# EAGLE schematic Sequencer-Logic-Prod-V2.1 (EAGLE 9.6.2)

## Sheet 1 of 10: uCode PC Counter
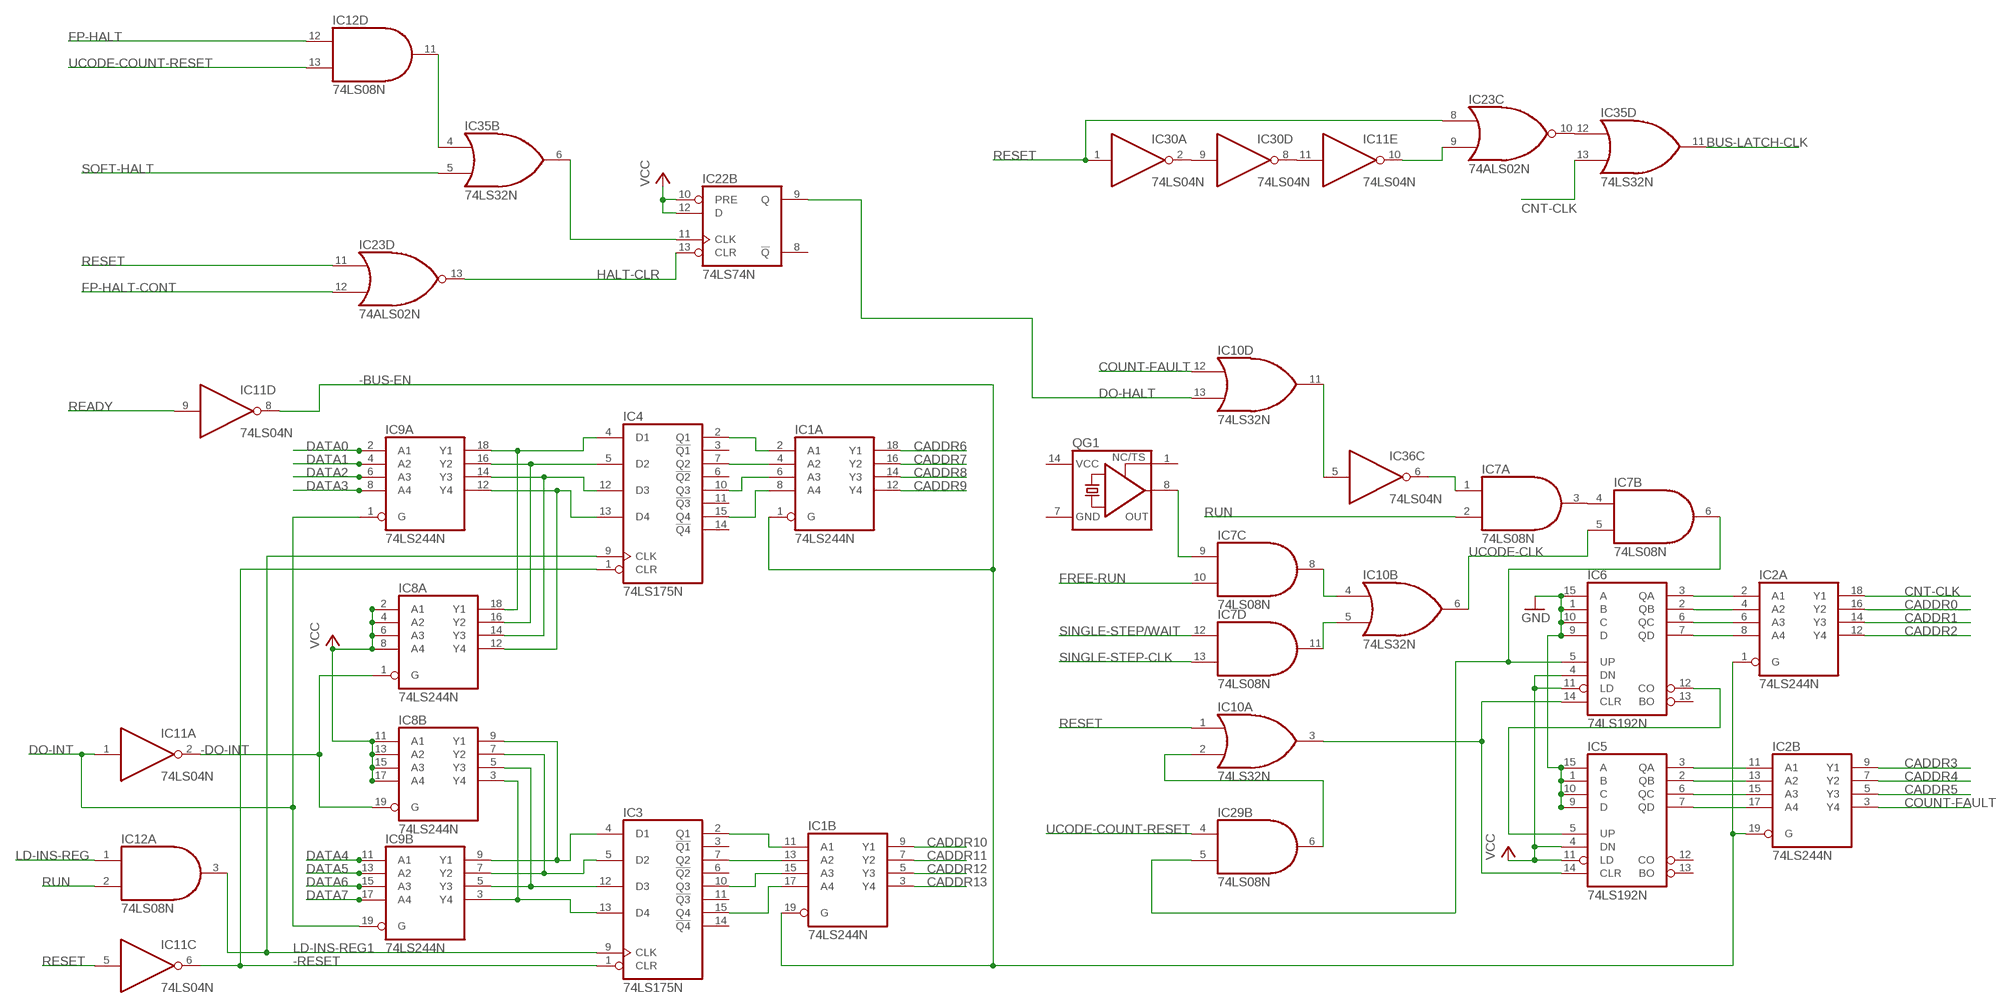
[diagram p0: schematic, sheet 1]

### Parts
IC1  74LS244N  [DIL20]
IC2  74LS244N  [DIL20]
IC3  74LS175N  [DIL16]
IC4  74LS175N  [DIL16]
IC5  74LS192N  [DIL16]
IC6  74LS192N  [DIL16]
IC7  74LS08N  [DIL14]
IC8  74LS244N  [DIL20]
IC9  74LS244N  [DIL20]
IC10  74LS32N  [DIL14]
IC11  74LS04N  [DIL14]
IC12  74LS08N  [DIL14]
IC22  74LS74N  [DIL14]
IC23  74ALS02N  [DIL14]
IC29  74LS08N  [DIL14]
IC30  74LS04N  [DIL14]
IC35  74LS32N  [DIL14]
IC36  74LS04N  [DIL14]
QG1  XO-14  [DIL14S]

### Nets
-BUS-EN: IC1.1(A:G) IC1.19(B:G) IC2.1(A:G) IC2.19(B:G) IC11.8(D:O) ; also sheet 2,10
-DO-INT: IC8.1(A:G) IC8.19(B:G) IC11.2(A:O)
-RESET: IC3.1(CLR) IC4.1(CLR) IC11.6(C:O) ; also sheet 10
BUS-LATCH-CLK: IC35.11(D:O) ; also sheet 2
CADDR0: IC2.16(A:Y2) ; also sheet 9
CADDR1: IC2.14(A:Y3) ; also sheet 9
CADDR2: IC2.12(A:Y4) ; also sheet 9
CADDR3: IC2.9(B:Y1) ; also sheet 9
CADDR4: IC2.7(B:Y2) ; also sheet 9
CADDR5: IC2.5(B:Y3) ; also sheet 9
CADDR6: IC1.18(A:Y1) ; also sheet 9
CADDR7: IC1.16(A:Y2) ; also sheet 9
CADDR8: IC1.14(A:Y3) ; also sheet 9
CADDR9: IC1.12(A:Y4) ; also sheet 9
CADDR10: IC1.9(B:Y1) ; also sheet 9
CADDR11: IC1.7(B:Y2) ; also sheet 9
CADDR12: IC1.5(B:Y3) ; also sheet 9
CADDR13: IC1.3(B:Y4) ; also sheet 9
CNT-CLK: IC2.18(A:Y1) IC35.13(D:I1)
COUNT-FAULT: IC2.3(B:Y4) IC10.12(D:I0)
COUNT-RESET: IC5.14(CLR) IC6.14(CLR) IC10.3(A:O)
DATA0: IC9.2(A:A1) ; also sheet 4,6,10
DATA1: IC9.4(A:A2) ; also sheet 4,6,10
DATA2: IC9.6(A:A3) ; also sheet 4,6,10
DATA3: IC9.8(A:A4) ; also sheet 4,6,10
DATA4: IC9.11(B:A1) ; also sheet 4,6,10
DATA5: IC9.13(B:A2) ; also sheet 4,6,10
DATA6: IC9.15(B:A3) ; also sheet 4,6,10
DATA7: IC9.17(B:A4) ; also sheet 4,6,10
DO-HALT: IC10.13(D:I1) IC22.9(B:Q)
DO-INT: IC9.1(A:G) IC9.19(B:G) IC11.1(A:I) ; also sheet 3
FP-HALT: IC12.12(D:I0) ; also sheet 5
FP-HALT-CONT: IC23.12(D:I1) ; also sheet 5
FREE-RUN: IC7.10(C:I1) ; also sheet 5
GND: IC5.1(B) IC5.9(D) IC5.10(C) IC5.15(A) IC6.1(B) IC6.9(D) IC6.10(C) IC6.15(A) ; also sheet 3,5,6,7,8,9,10
HALT-CLR: IC22.13(B:CLR) IC23.13(D:O)
LD-INS-REG: IC12.1(A:I0) ; also sheet 2
LD-INS-REG1: IC3.9(CLK) IC4.9(CLK) IC12.3(A:O)
N$1: IC5.5(UP) IC6.12(CO)
N$2: IC1.2(A:A1) IC4.2(Q1)
N$3: IC1.4(A:A2) IC4.7(Q2)
N$4: IC6.5(UP) IC7.6(B:O) IC29.5(B:I1)
N$5: IC4.4(D1) IC8.18(A:Y1) IC9.18(A:Y1)
N$6: IC4.5(D2) IC8.16(A:Y2) IC9.16(A:Y2)
N$7: IC2.2(A:A1) IC6.3(QA)
N$8: IC2.4(A:A2) IC6.2(QB)
N$9: IC2.6(A:A3) IC6.6(QC)
N$10: IC1.6(A:A3) IC4.10(Q3)
N$11: IC2.8(A:A4) IC6.7(QD)
N$12: IC2.11(B:A1) IC5.3(QA)
N$13: IC2.13(B:A2) IC5.2(QB)
N$14: IC2.15(B:A3) IC5.6(QC)
N$15: IC2.17(B:A4) IC5.7(QD)
N$16: IC7.1(A:I0) IC36.6(C:O)
N$17: IC4.12(D3) IC8.14(A:Y3) IC9.14(A:Y3)
N$18: IC4.13(D4) IC8.12(A:Y4) IC9.12(A:Y4)
N$19: IC3.4(D1) IC8.9(B:Y1) IC9.9(B:Y1)
N$20: IC3.5(D2) IC8.7(B:Y2) IC9.7(B:Y2)
N$21: IC3.12(D3) IC8.5(B:Y3) IC9.5(B:Y3)
N$22: IC3.13(D4) IC8.3(B:Y4) IC9.3(B:Y4)
N$23: IC1.8(A:A4) IC4.15(Q4)
N$26: IC10.11(D:O) IC36.5(C:I)
N$31: IC7.3(A:O) IC7.4(B:I0)
N$32: IC23.10(C:O) IC35.12(D:I0)
N$33: IC22.11(B:CLK) IC35.6(B:O)
N$34: IC1.11(B:A1) IC3.2(Q1)
N$35: IC1.13(B:A2) IC3.7(Q2)
N$36: IC1.15(B:A3) IC3.10(Q3)
N$37: IC1.17(B:A4) IC3.15(Q4)
N$38: IC7.11(D:O) IC10.5(B:I1)
N$39: IC7.8(C:O) IC10.4(B:I0)
N$40: IC7.9(C:I0) QG1.8(OUT)
N$42: IC11.11(E:I) IC30.8(D:O)
N$44: IC30.2(A:O) IC30.9(D:I)
N$46: IC11.10(E:O) IC23.9(C:I1)
N$54: IC12.11(D:O) IC35.4(B:I0)
N$55: IC10.2(A:I1) IC29.6(B:O)
READY: IC11.9(D:I) ; also sheet 9
RESET: IC10.1(A:I0) IC11.5(C:I) IC23.8(C:I0) IC23.11(D:I0) IC30.1(A:I) ; also sheet 3,5
RUN: IC7.2(A:I1) IC12.2(A:I1) ; also sheet 5
SINGLE-STEP-CLK: IC7.13(D:I1) ; also sheet 5
SINGLE-STEP/WAIT: IC7.12(D:I0) ; also sheet 5
SOFT-HALT: IC35.5(B:I1) ; also sheet 2
UCODE-CLK: IC7.5(B:I1) IC10.6(B:O)
UCODE-COUNT-RESET: IC12.13(D:I1) IC29.4(B:I0) ; also sheet 2,4
VCC: IC5.4(DN) IC5.11(LD) IC6.4(DN) IC6.11(LD) IC8.2(A:A1) IC8.4(A:A2) IC8.6(A:A3) IC8.8(A:A4) IC8.11(B:A1) IC8.13(B:A2) IC8.15(B:A3) IC8.17(B:A4) IC22.10(B:PRE) IC22.12(B:D) ; also sheet 3,5,7,9,10
Unconnected: IC3.3(!Q1) IC3.6(!Q2) IC3.11(!Q3) IC3.14(!Q4) IC4.3(!Q1) IC4.6(!Q2) IC4.11(!Q3) IC4.14(!Q4) IC5.12(CO) IC5.13(BO) IC6.13(BO) IC22.8(B:!Q) QG1.1(TS)

## Sheet 2 of 10: Latching
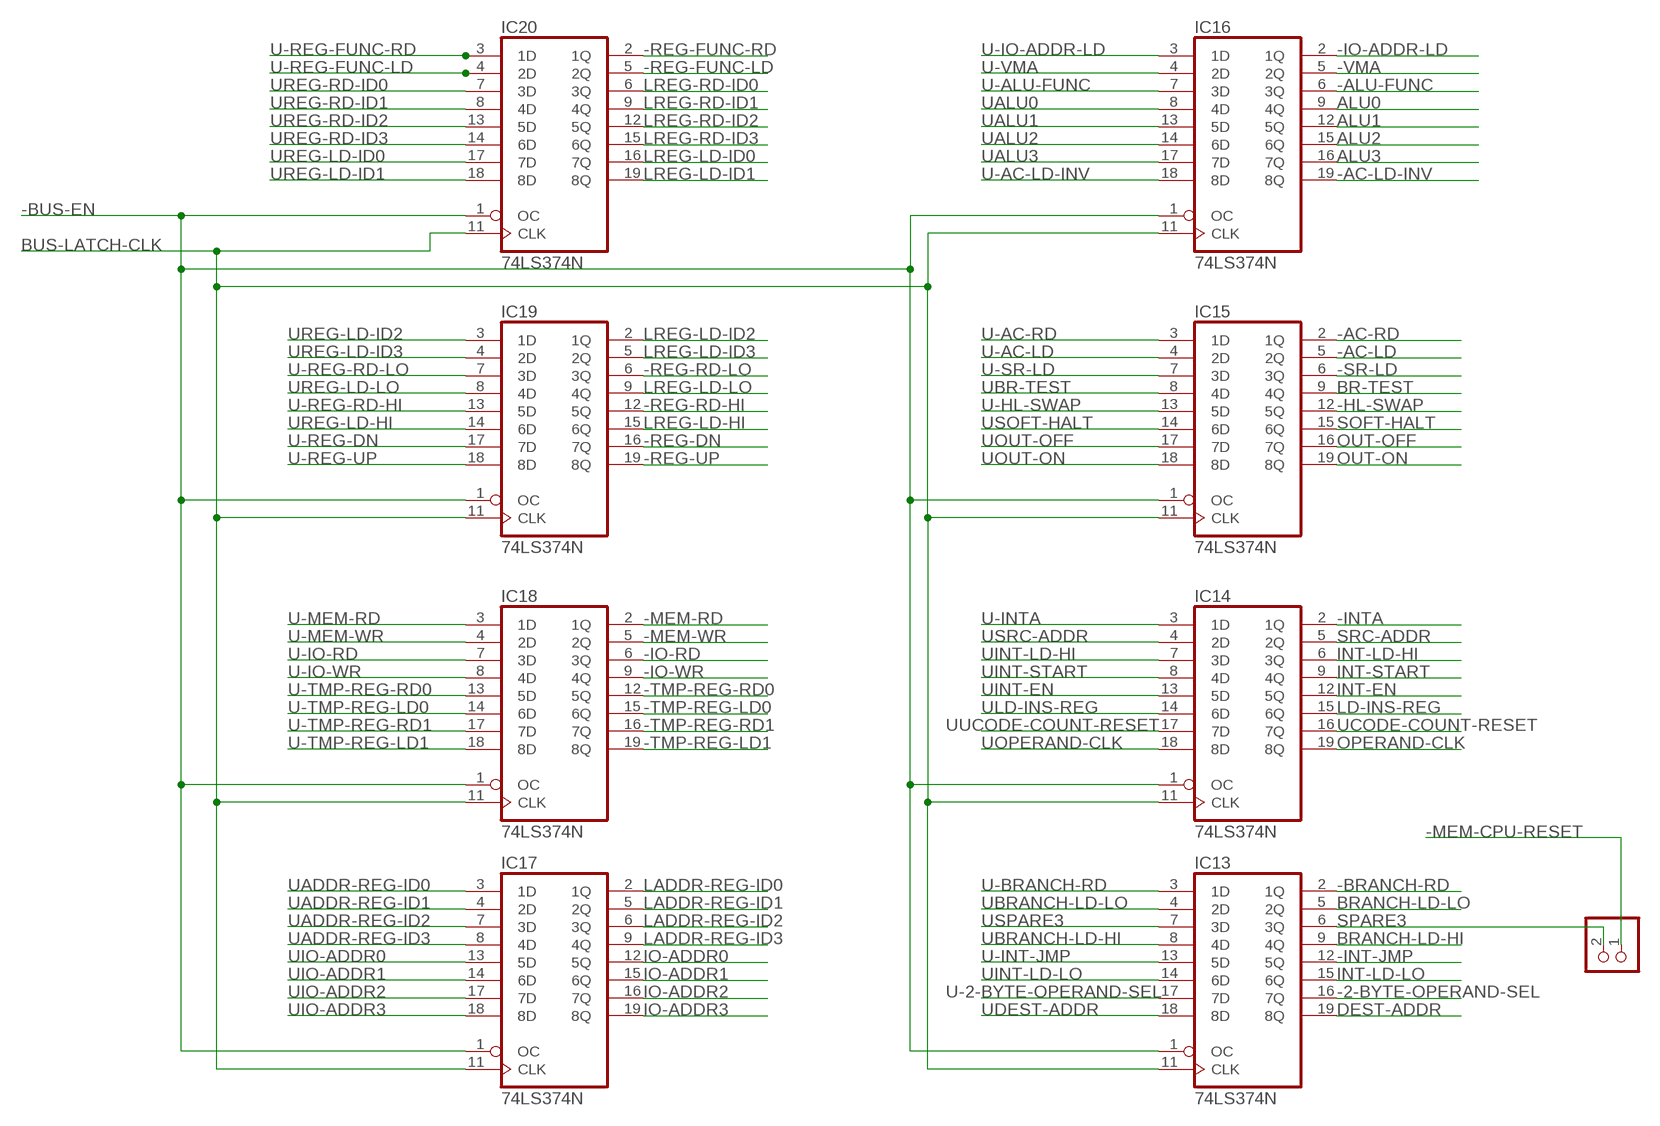
[diagram p1: schematic, sheet 2]

### Parts
IC13  74LS374N  [DIL20]
IC14  74LS374N  [DIL20]
IC15  74LS374N  [DIL20]
IC16  74LS374N  [DIL20]
IC17  74LS374N  [DIL20]
IC18  74LS374N  [DIL20]
IC19  74LS374N  [DIL20]
IC20  74LS374N  [DIL20]
JP2  PINHD-1X2  [1X02]

### Nets
-2-BYTE-OPERAND-SEL: IC13.16(7Q) ; also sheet 6
-AC-LD: IC15.5(2Q) ; also sheet 10
-AC-LD-INV: IC16.19(8Q) ; also sheet 10
-AC-RD: IC15.2(1Q) ; also sheet 10
-ALU-FUNC: IC16.6(3Q) ; also sheet 10
-BRANCH-RD: IC13.2(1Q) ; also sheet 4
-BUS-EN: IC13.1(OC) IC14.1(OC) IC15.1(OC) IC16.1(OC) IC17.1(OC) IC18.1(OC) IC19.1(OC) IC20.1(OC) ; also sheet 1,10
-HL-SWAP: IC15.12(5Q) ; also sheet 10
-INT-JMP: IC13.12(5Q) ; also sheet 4
-INTA: IC14.2(1Q) ; also sheet 10
-IO-ADDR-LD: IC16.2(1Q) ; also sheet 10
-IO-RD: IC18.6(3Q) ; also sheet 10
-IO-WR: IC18.9(4Q) ; also sheet 10
-MEM-CPU-RESET: JP2.1 ; also sheet 9
-MEM-RD: IC18.2(1Q) ; also sheet 10
-MEM-WR: IC18.5(2Q) ; also sheet 10
-REG-DN: IC19.16(7Q) ; also sheet 10
-REG-FUNC-LD: IC20.5(2Q) ; also sheet 10
-REG-FUNC-RD: IC20.2(1Q) ; also sheet 10
-REG-RD-HI: IC19.12(5Q) ; also sheet 10
-REG-RD-LO: IC19.6(3Q) ; also sheet 10
-REG-UP: IC19.19(8Q) ; also sheet 10
-SR-LD: IC15.6(3Q) ; also sheet 10
-TMP-REG-LD0: IC18.15(6Q) ; also sheet 10
-TMP-REG-LD1: IC18.19(8Q) ; also sheet 10
-TMP-REG-RD0: IC18.12(5Q) ; also sheet 10
-TMP-REG-RD1: IC18.16(7Q) ; also sheet 10
-VMA: IC16.5(2Q) ; also sheet 10
ALU0: IC16.9(4Q) ; also sheet 10
ALU1: IC16.12(5Q) ; also sheet 10
ALU2: IC16.15(6Q) ; also sheet 10
ALU3: IC16.16(7Q) ; also sheet 10
BR-TEST: IC15.9(4Q) ; also sheet 4
BRANCH-LD-HI: IC13.9(4Q) ; also sheet 4
BRANCH-LD-LO: IC13.5(2Q) ; also sheet 4
BUS-LATCH-CLK: IC13.11(CLK) IC14.11(CLK) IC15.11(CLK) IC16.11(CLK) IC17.11(CLK) IC18.11(CLK) IC19.11(CLK) IC20.11(CLK) ; also sheet 1
DEST-ADDR: IC13.19(8Q) ; also sheet 6
INT-EN: IC14.12(5Q) ; also sheet 3
INT-LD-HI: IC14.6(3Q) ; also sheet 4
INT-LD-LO: IC13.15(6Q) ; also sheet 4
INT-START: IC14.9(4Q) ; also sheet 3
IO-ADDR0: IC17.12(5Q) ; also sheet 10
IO-ADDR1: IC17.15(6Q) ; also sheet 10
IO-ADDR2: IC17.16(7Q) ; also sheet 10
IO-ADDR3: IC17.19(8Q) ; also sheet 10
LADDR-REG-ID0: IC17.2(1Q) ; also sheet 6
LADDR-REG-ID1: IC17.5(2Q) ; also sheet 6
LADDR-REG-ID2: IC17.6(3Q) ; also sheet 6
LADDR-REG-ID3: IC17.9(4Q) ; also sheet 6
LD-INS-REG: IC14.15(6Q) ; also sheet 1
LREG-LD-HI: IC19.15(6Q) ; also sheet 4
LREG-LD-ID0: IC20.16(7Q) ; also sheet 6
LREG-LD-ID1: IC20.19(8Q) ; also sheet 6
LREG-LD-ID2: IC19.2(1Q) ; also sheet 6
LREG-LD-ID3: IC19.5(2Q) ; also sheet 6
LREG-LD-LO: IC19.9(4Q) ; also sheet 4
LREG-RD-ID0: IC20.6(3Q) ; also sheet 6
LREG-RD-ID1: IC20.9(4Q) ; also sheet 6
LREG-RD-ID2: IC20.12(5Q) ; also sheet 6
LREG-RD-ID3: IC20.15(6Q) ; also sheet 6
OPERAND-CLK: IC14.19(8Q) ; also sheet 6
OUT-OFF: IC15.16(7Q) ; also sheet 3
OUT-ON: IC15.19(8Q) ; also sheet 3
SOFT-HALT: IC15.15(6Q) ; also sheet 1
SPARE3: IC13.6(3Q) JP2.2
SRC-ADDR: IC14.5(2Q) ; also sheet 6
U-2-BYTE-OPERAND-SEL: IC13.17(7D) ; also sheet 9
U-AC-LD: IC15.4(2D) ; also sheet 9
U-AC-LD-INV: IC16.18(8D) ; also sheet 9
U-AC-RD: IC15.3(1D) ; also sheet 9
U-ALU-FUNC: IC16.7(3D) ; also sheet 9
U-BRANCH-RD: IC13.3(1D) ; also sheet 9
U-HL-SWAP: IC15.13(5D) ; also sheet 9
U-INT-JMP: IC13.13(5D) ; also sheet 9
U-INTA: IC14.3(1D) ; also sheet 9
U-IO-ADDR-LD: IC16.3(1D) ; also sheet 9
U-IO-RD: IC18.7(3D) ; also sheet 9
U-IO-WR: IC18.8(4D) ; also sheet 9
U-MEM-RD: IC18.3(1D) ; also sheet 9
U-MEM-WR: IC18.4(2D) ; also sheet 9
U-REG-DN: IC19.17(7D) ; also sheet 9
U-REG-FUNC-LD: IC20.4(2D) ; also sheet 9
U-REG-FUNC-RD: IC20.3(1D) ; also sheet 9
U-REG-RD-HI: IC19.13(5D) ; also sheet 9
U-REG-RD-LO: IC19.7(3D) ; also sheet 9
U-REG-UP: IC19.18(8D) ; also sheet 9
U-SR-LD: IC15.7(3D) ; also sheet 9
U-TMP-REG-LD0: IC18.14(6D) ; also sheet 9
U-TMP-REG-LD1: IC18.18(8D) ; also sheet 9
U-TMP-REG-RD0: IC18.13(5D) ; also sheet 9
U-TMP-REG-RD1: IC18.17(7D) ; also sheet 9
U-VMA: IC16.4(2D) ; also sheet 9
UADDR-REG-ID0: IC17.3(1D) ; also sheet 9
UADDR-REG-ID1: IC17.4(2D) ; also sheet 9
UADDR-REG-ID2: IC17.7(3D) ; also sheet 9
UADDR-REG-ID3: IC17.8(4D) ; also sheet 9
UALU0: IC16.8(4D) ; also sheet 9
UALU1: IC16.13(5D) ; also sheet 9
UALU2: IC16.14(6D) ; also sheet 9
UALU3: IC16.17(7D) ; also sheet 9
UBR-TEST: IC15.8(4D) ; also sheet 9
UBRANCH-LD-HI: IC13.8(4D) ; also sheet 9
UBRANCH-LD-LO: IC13.4(2D) ; also sheet 9
UCODE-COUNT-RESET: IC14.16(7Q) ; also sheet 1,4
UDEST-ADDR: IC13.18(8D) ; also sheet 9
UINT-EN: IC14.13(5D) ; also sheet 9
UINT-LD-HI: IC14.7(3D) ; also sheet 9
UINT-LD-LO: IC13.14(6D) ; also sheet 9
UINT-START: IC14.8(4D) ; also sheet 9
UIO-ADDR0: IC17.13(5D) ; also sheet 9
UIO-ADDR1: IC17.14(6D) ; also sheet 9
UIO-ADDR2: IC17.17(7D) ; also sheet 9
UIO-ADDR3: IC17.18(8D) ; also sheet 9
ULD-INS-REG: IC14.14(6D) ; also sheet 9
UOPERAND-CLK: IC14.18(8D) ; also sheet 9
UOUT-OFF: IC15.17(7D) ; also sheet 9
UOUT-ON: IC15.18(8D) ; also sheet 9
UREG-LD-HI: IC19.14(6D) ; also sheet 9
UREG-LD-ID0: IC20.17(7D) ; also sheet 9
UREG-LD-ID1: IC20.18(8D) ; also sheet 9
UREG-LD-ID2: IC19.3(1D) ; also sheet 9
UREG-LD-ID3: IC19.4(2D) ; also sheet 9
UREG-LD-LO: IC19.8(4D) ; also sheet 9
UREG-RD-ID0: IC20.7(3D) ; also sheet 9
UREG-RD-ID1: IC20.8(4D) ; also sheet 9
UREG-RD-ID2: IC20.13(5D) ; also sheet 9
UREG-RD-ID3: IC20.14(6D) ; also sheet 9
USOFT-HALT: IC15.14(6D) ; also sheet 9
USPARE3: IC13.7(3D) ; also sheet 9
USRC-ADDR: IC14.4(2D) ; also sheet 9
UUCODE-COUNT-RESET: IC14.17(7D) ; also sheet 9

## Sheet 3 of 10: Interrupt Mgmt
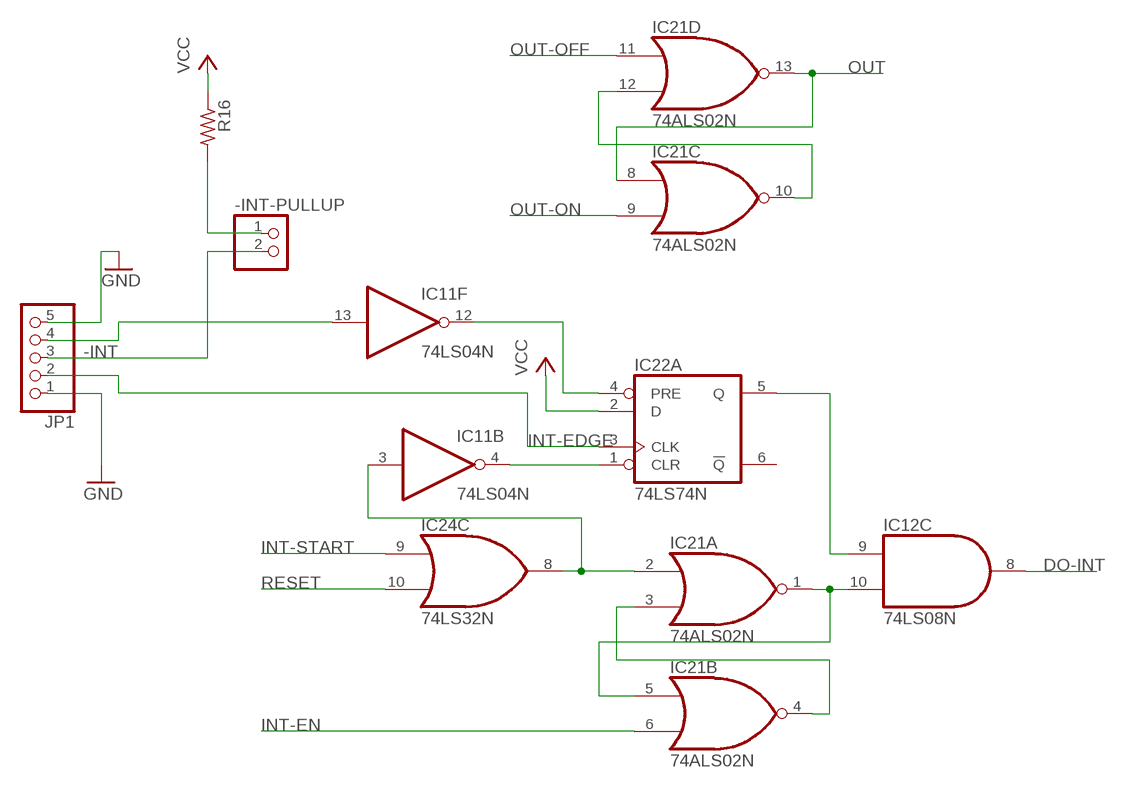
[diagram p2: schematic, sheet 3]

### Parts
-INT-PULLUP  PINHD-1X2  [1X02]
IC21  74ALS02N  [DIL14]
IC24  74LS32N  [DIL14]
JP1  PINHD-1X5  [1X05]
R16  10k  R-US_0207/10  [0207/10]

### Nets
-INT: -INT-PULLUP.2 JP1.3 ; also sheet 10
DO-INT: IC12.8(C:O) ; also sheet 1
GND: JP1.1 JP1.5 ; also sheet 1,5,6,7,8,9,10
INT-EDGE: IC22.3(A:CLK) JP1.2
INT-EN: IC21.6(B:I1) ; also sheet 2
INT-START: IC24.9(C:I0) ; also sheet 2
N$24: IC12.10(C:I1) IC21.1(A:O) IC21.5(B:I0)
N$25: IC21.3(A:I1) IC21.4(B:O)
N$27: IC11.3(B:I) IC21.2(A:I0) IC24.8(C:O)
N$28: IC12.9(C:I0) IC22.5(A:Q)
N$29: IC11.4(B:O) IC22.1(A:CLR)
N$41: IC11.12(F:O) IC22.4(A:PRE)
N$43: IC11.13(F:I) JP1.4
N$48: IC21.10(C:O) IC21.12(D:I1)
N$49: -INT-PULLUP.1 R16.2
OUT: IC21.8(C:I0) IC21.13(D:O) ; also sheet 5,10
OUT-OFF: IC21.11(D:I0) ; also sheet 2
OUT-ON: IC21.9(C:I1) ; also sheet 2
RESET: IC24.10(C:I1) ; also sheet 1,5
VCC: IC22.2(A:D) R16.1 ; also sheet 1,5,7,9,10
Unconnected: IC22.6(A:!Q)

## Sheet 4 of 10: Branch Mgmt
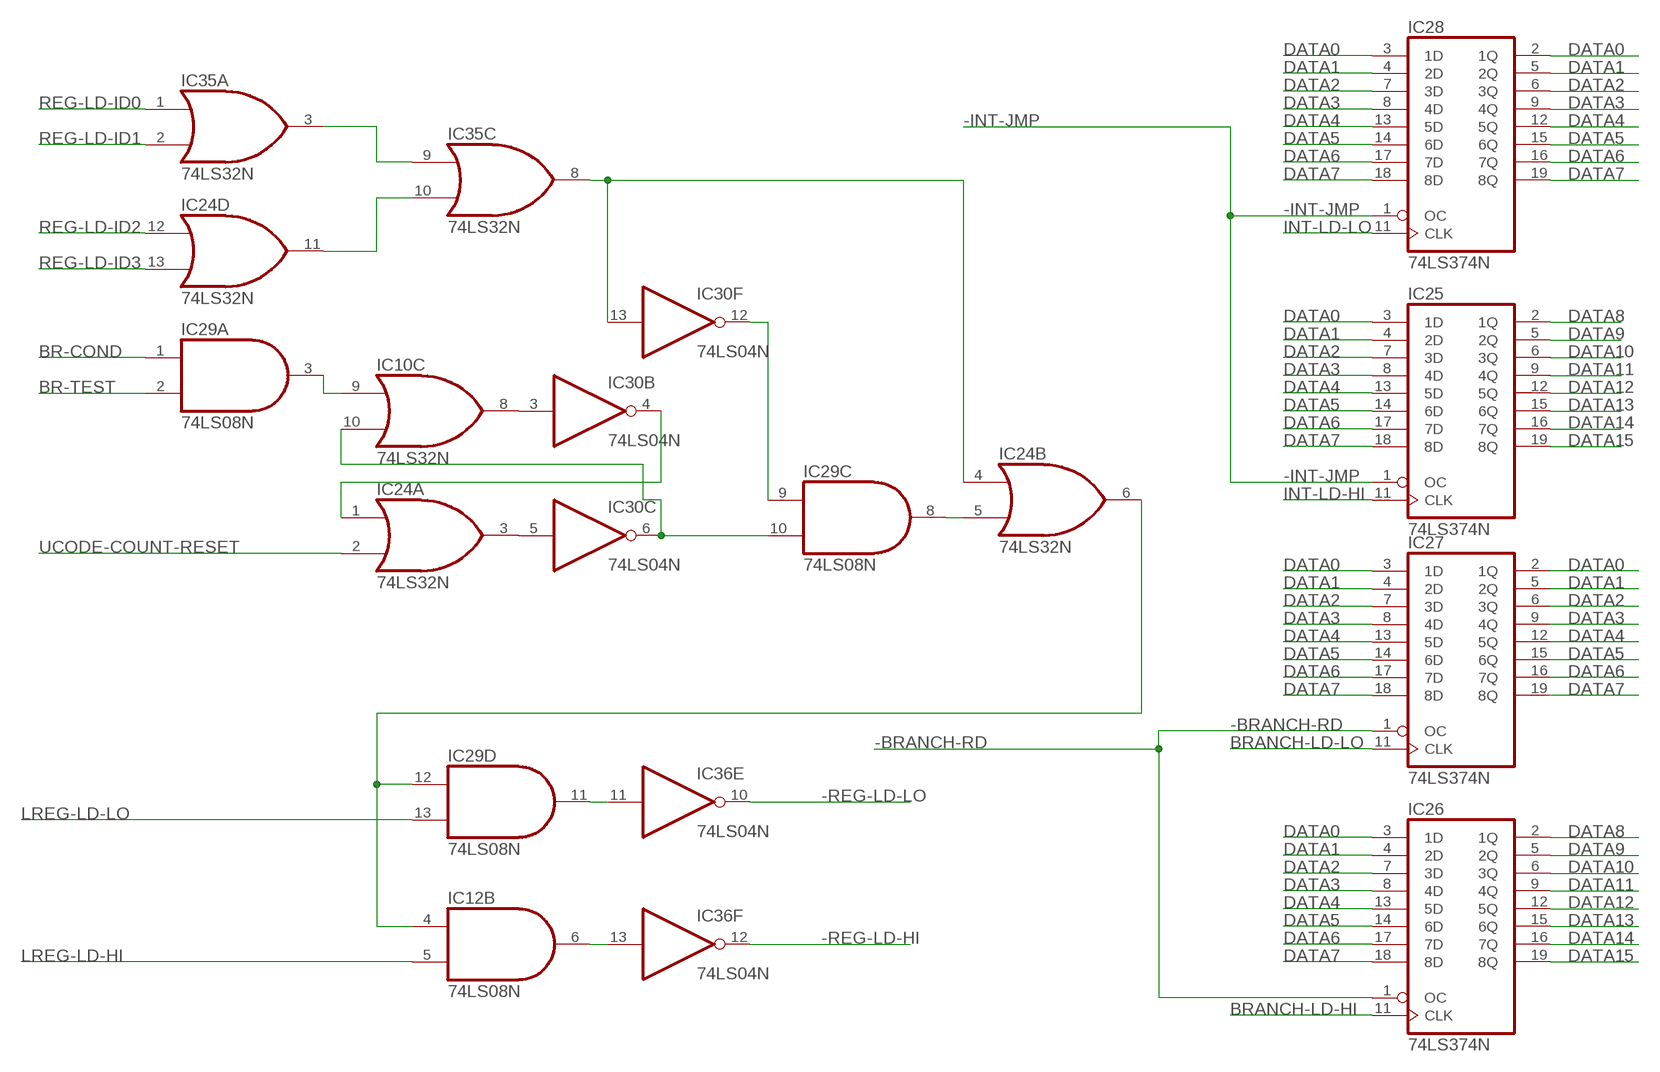
[diagram p3: schematic, sheet 4]

### Parts
IC25  74LS374N  [DIL20]
IC26  74LS374N  [DIL20]
IC27  74LS374N  [DIL20]
IC28  74LS374N  [DIL20]

### Nets
-BRANCH-RD: IC26.1(OC) IC27.1(OC) ; also sheet 2
-INT-JMP: IC25.1(OC) IC28.1(OC) ; also sheet 2
-REG-LD-HI: IC36.12(F:O) ; also sheet 10
-REG-LD-LO: IC36.10(E:O) ; also sheet 10
BR-COND: IC29.1(A:I0) ; also sheet 10
BR-TEST: IC29.2(A:I1) ; also sheet 2
BRANCH-LD-HI: IC26.11(CLK) ; also sheet 2
BRANCH-LD-LO: IC27.11(CLK) ; also sheet 2
DATA0: IC25.3(1D) IC26.3(1D) IC27.2(1Q) IC27.3(1D) IC28.2(1Q) IC28.3(1D) ; also sheet 1,6,10
DATA1: IC25.4(2D) IC26.4(2D) IC27.4(2D) IC27.5(2Q) IC28.4(2D) IC28.5(2Q) ; also sheet 1,6,10
DATA2: IC25.7(3D) IC26.7(3D) IC27.6(3Q) IC27.7(3D) IC28.6(3Q) IC28.7(3D) ; also sheet 1,6,10
DATA3: IC25.8(4D) IC26.8(4D) IC27.8(4D) IC27.9(4Q) IC28.8(4D) IC28.9(4Q) ; also sheet 1,6,10
DATA4: IC25.13(5D) IC26.13(5D) IC27.12(5Q) IC27.13(5D) IC28.12(5Q) IC28.13(5D) ; also sheet 1,6,10
DATA5: IC25.14(6D) IC26.14(6D) IC27.14(6D) IC27.15(6Q) IC28.14(6D) IC28.15(6Q) ; also sheet 1,6,10
DATA6: IC25.17(7D) IC26.17(7D) IC27.16(7Q) IC27.17(7D) IC28.16(7Q) IC28.17(7D) ; also sheet 1,6,10
DATA7: IC25.18(8D) IC26.18(8D) IC27.18(8D) IC27.19(8Q) IC28.18(8D) IC28.19(8Q) ; also sheet 1,6,10
DATA8: IC25.2(1Q) IC26.2(1Q) ; also sheet 10
DATA9: IC25.5(2Q) IC26.5(2Q) ; also sheet 10
DATA10: IC25.6(3Q) IC26.6(3Q) ; also sheet 10
DATA11: IC25.9(4Q) IC26.9(4Q) ; also sheet 10
DATA12: IC25.12(5Q) IC26.12(5Q) ; also sheet 10
DATA13: IC25.15(6Q) IC26.15(6Q) ; also sheet 10
DATA14: IC25.16(7Q) IC26.16(7Q) ; also sheet 10
DATA15: IC25.19(8Q) IC26.19(8Q) ; also sheet 10
INT-LD-HI: IC25.11(CLK) ; also sheet 2
INT-LD-LO: IC28.11(CLK) ; also sheet 2
LREG-LD-HI: IC12.5(B:I1) ; also sheet 2
LREG-LD-LO: IC29.13(D:I1) ; also sheet 2
N$45: IC35.3(A:O) IC35.9(C:I0)
N$47: IC24.11(D:O) IC35.10(C:I1)
N$51: IC29.9(C:I0) IC30.12(F:O)
N$52: IC24.5(B:I1) IC29.8(C:O)
N$53: IC12.4(B:I0) IC24.6(B:O) IC29.12(D:I0)
N$56: IC24.4(B:I0) IC30.13(F:I) IC35.8(C:O)
N$57: IC29.11(D:O) IC36.11(E:I)
N$58: IC12.6(B:O) IC36.13(F:I)
N$60: IC10.8(C:O) IC30.3(B:I)
N$67: IC24.3(A:O) IC30.5(C:I)
N$70: IC24.1(A:I0) IC30.4(B:O)
N$71: IC10.10(C:I1) IC29.10(C:I1) IC30.6(C:O)
N$72: IC10.9(C:I0) IC29.3(A:O)
REG-LD-ID0: IC35.1(A:I0) ; also sheet 6,10
REG-LD-ID1: IC35.2(A:I1) ; also sheet 6,10
REG-LD-ID2: IC24.12(D:I0) ; also sheet 6,10
REG-LD-ID3: IC24.13(D:I1) ; also sheet 6,10
UCODE-COUNT-RESET: IC24.2(A:I1) ; also sheet 1,2

## Sheet 5 of 10: CONTROL INTERFACE
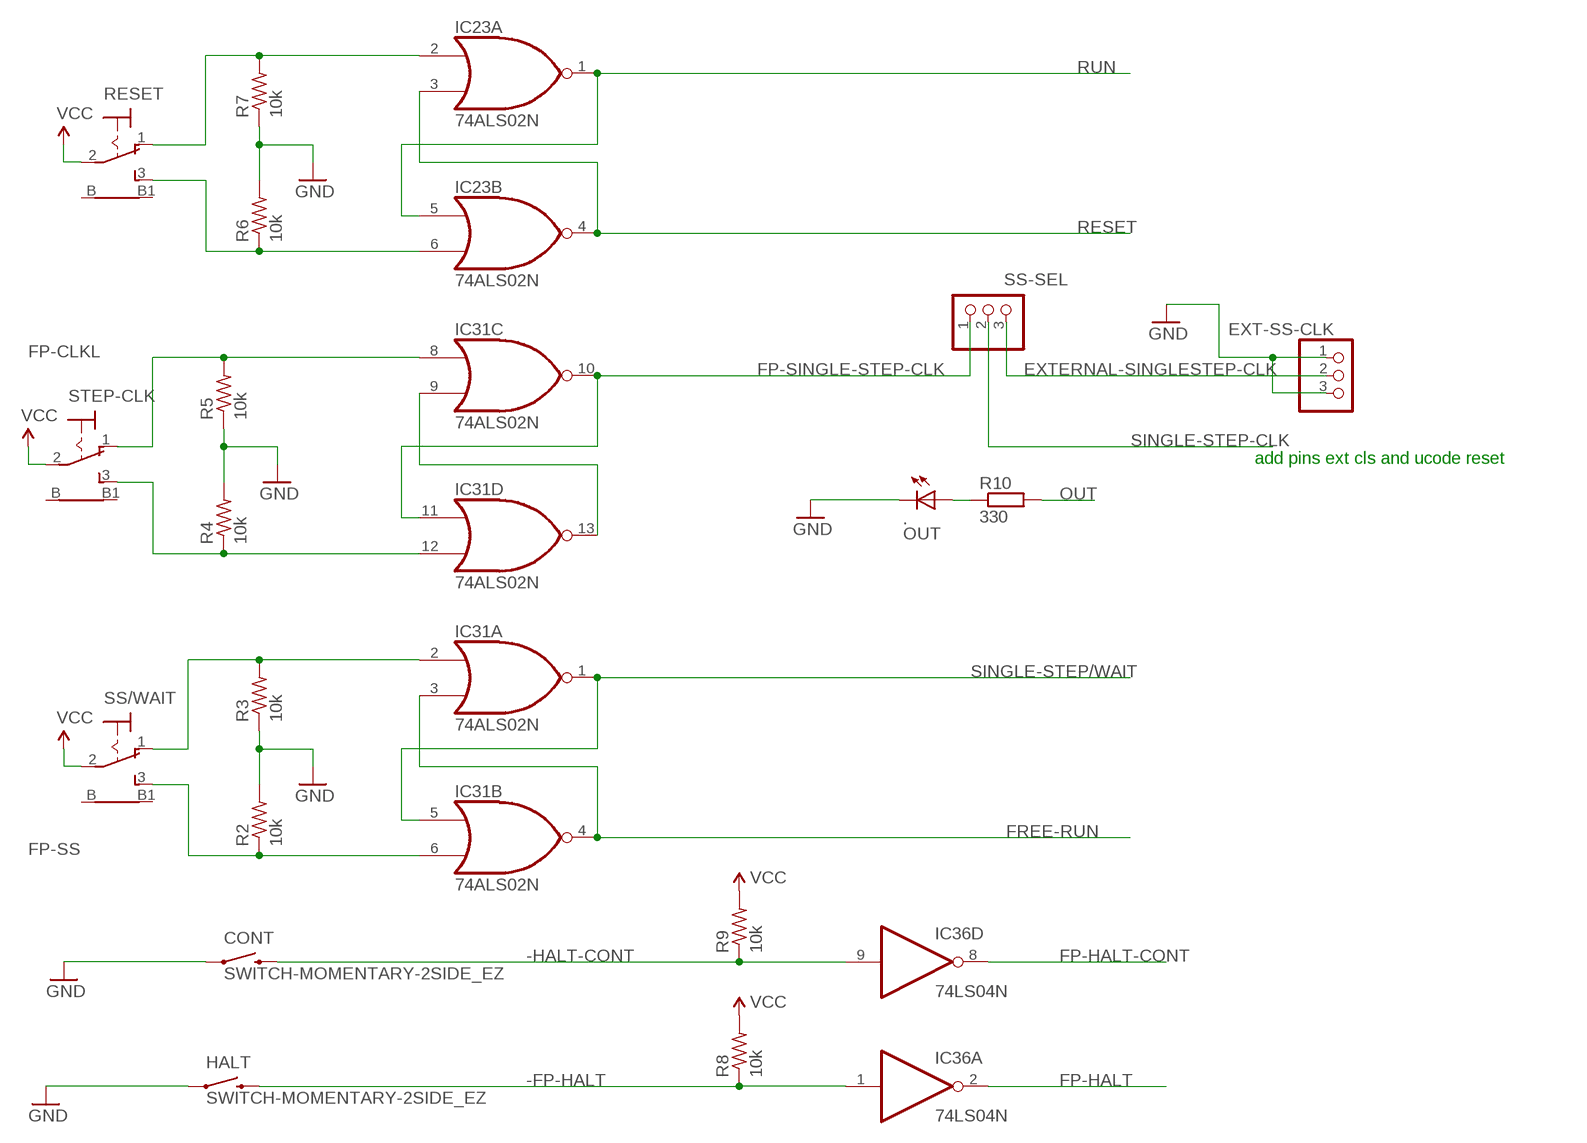
[diagram p4: schematic, sheet 5]

### Parts
.  OUT  LED5MM  [LED5MM]
CONT  SWITCH-MOMENTARY-2SIDE_EZ  [TACTILE-PTH-SIDEEZ]
EXT-SS-CLK  PINHD-1X3  [1X03]
HALT  SWITCH-MOMENTARY-2SIDE_EZ  [TACTILE-PTH-SIDEEZ]
IC31  74ALS02N  [DIL14]
R2  10k  R-US_0207/10  [0207/10]
R3  10k  R-US_0207/10  [0207/10]
R4  10k  R-US_0207/10  [0207/10]
R5  10k  R-US_0207/10  [0207/10]
R6  10k  R-US_0207/10  [0207/10]
R7  10k  R-US_0207/10  [0207/10]
R8  10k  R-US_0207/10  [0207/10]
R9  10k  R-US_0207/10  [0207/10]
R10  330  R0207/10  [0207/10]
RESET  9070-1W  [9070-1W]
SS-SEL  PINHD-1X3  [1X03]
SS/WAIT  9070-1W  [9070-1W]
STEP-CLK  9070-1W  [9070-1W]

### Nets
-FP-HALT: HALT.2 IC36.1(A:I) R8.1
-HALT-CONT: CONT.2 IC36.9(D:I) R9.1
EXTERNAL-SINGLESTEP-CLK: EXT-SS-CLK.2 SS-SEL.3
FP-CLKH: IC31.12(D:I1) R4.1 STEP-CLK.3(S)
FP-CLKL: IC31.8(C:I0) R5.2 STEP-CLK.1(O)
FP-EXECUTE: IC23.6(B:I1) R6.1 RESET.3(S)
FP-FREERUN: IC31.2(A:I0) R3.2 SS/WAIT.1(O)
FP-HALT: IC36.2(A:O) ; also sheet 1
FP-HALT-CONT: IC36.8(D:O) ; also sheet 1
FP-RESET: IC23.2(A:I0) R7.2 RESET.1(O)
FP-SINGLE-STEP-CLK: IC31.10(C:O) IC31.11(D:I0) SS-SEL.1
FP-SS: IC31.6(B:I1) R2.1 SS/WAIT.3(S)
FREE-RUN: IC31.3(A:I1) IC31.4(B:O) ; also sheet 1
GND: ..K(C) CONT.1 EXT-SS-CLK.1 EXT-SS-CLK.3 HALT.1 R2.2 R3.1 R4.2 R5.1 R6.2 R7.1 ; also sheet 1,3,6,7,8,9,10
HARD-RESET1: IC31.9(C:I1) IC31.13(D:O)
N$59: ..A R10.1
OUT: R10.2 ; also sheet 3,10
RESET: IC23.3(A:I1) IC23.4(B:O) ; also sheet 1,3
RUN: IC23.1(A:O) IC23.5(B:I0) ; also sheet 1
SINGLE-STEP-CLK: SS-SEL.2 ; also sheet 1
SINGLE-STEP/WAIT: IC31.1(A:O) IC31.5(B:I0) ; also sheet 1
VCC: R8.2 R9.2 RESET.2(P) SS/WAIT.2(P) STEP-CLK.2(P) ; also sheet 1,3,7,9,10
Unconnected: RESET.B RESET.B1 SS/WAIT.B SS/WAIT.B1 STEP-CLK.B STEP-CLK.B1

### Notes on the sheet
- add pins ext cls and ucode reset

## Sheet 6 of 10: OPERAND REGISTER MGMT
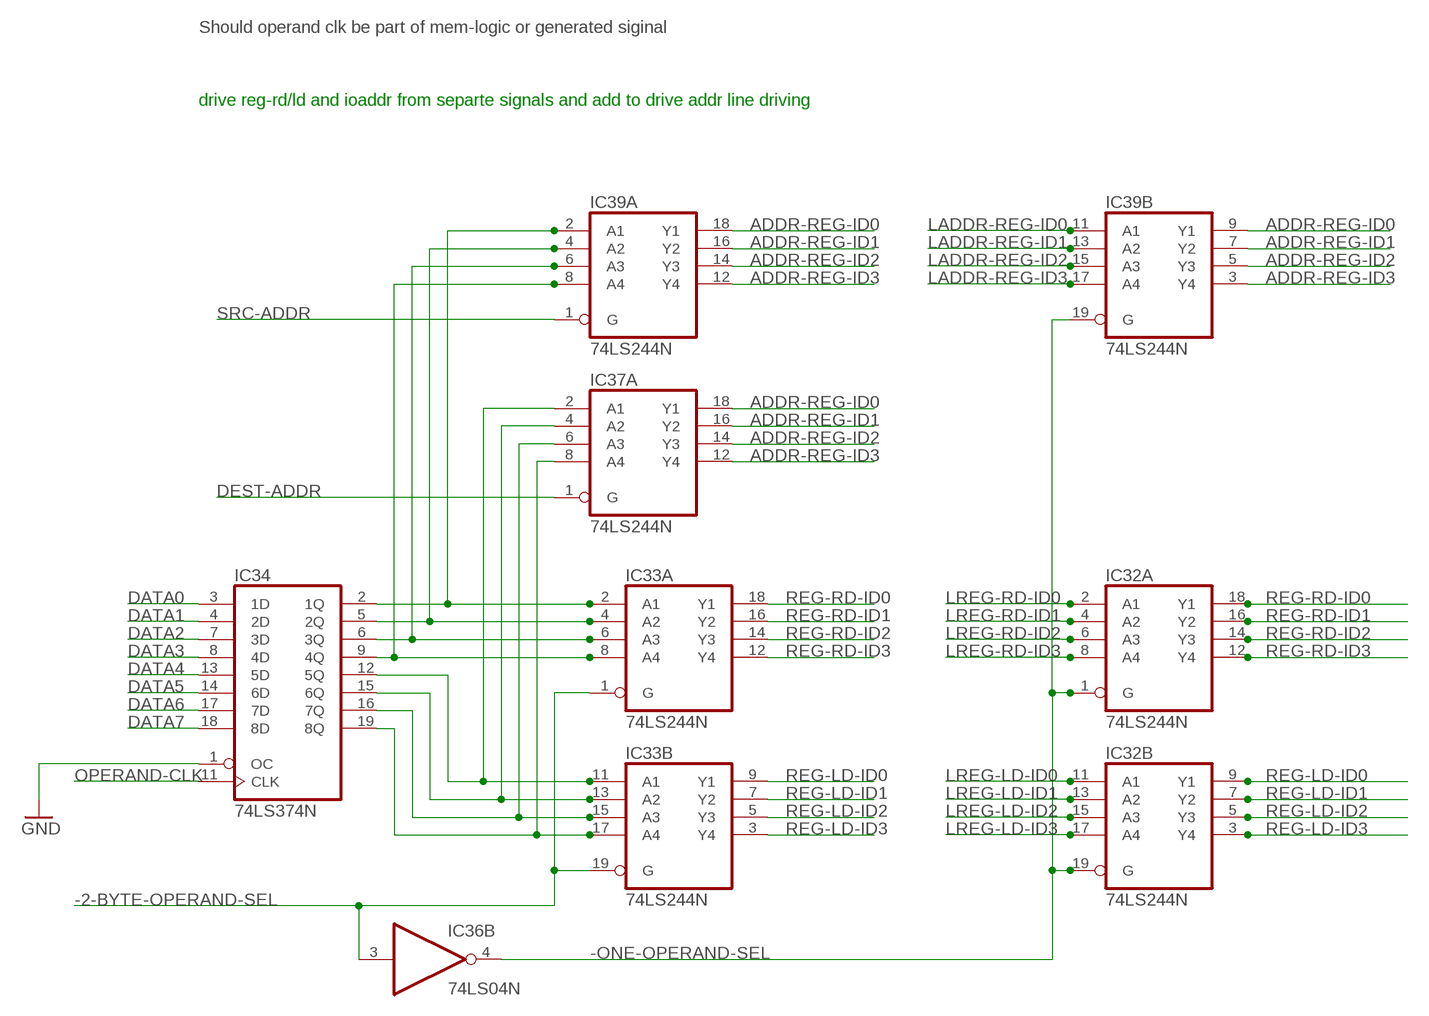
[diagram p5: schematic, sheet 6]

### Parts
IC32  74LS244N  [DIL20]
IC33  74LS244N  [DIL20]
IC34  74LS374N  [DIL20]
IC37  74LS244N  [DIL20]
IC39  74LS244N  [DIL20]

### Nets
-2-BYTE-OPERAND-SEL: IC33.1(A:G) IC33.19(B:G) IC36.3(B:I) ; also sheet 2
-ONE-OPERAND-SEL: IC32.1(A:G) IC32.19(B:G) IC36.4(B:O) IC39.19(B:G)
ADDR-REG-ID0: IC37.18(A:Y1) IC39.9(B:Y1) IC39.18(A:Y1) ; also sheet 10
ADDR-REG-ID1: IC37.16(A:Y2) IC39.7(B:Y2) IC39.16(A:Y2) ; also sheet 10
ADDR-REG-ID2: IC37.14(A:Y3) IC39.5(B:Y3) IC39.14(A:Y3) ; also sheet 10
ADDR-REG-ID3: IC37.12(A:Y4) IC39.3(B:Y4) IC39.12(A:Y4) ; also sheet 10
DATA0: IC34.3(1D) ; also sheet 1,4,10
DATA1: IC34.4(2D) ; also sheet 1,4,10
DATA2: IC34.7(3D) ; also sheet 1,4,10
DATA3: IC34.8(4D) ; also sheet 1,4,10
DATA4: IC34.13(5D) ; also sheet 1,4,10
DATA5: IC34.14(6D) ; also sheet 1,4,10
DATA6: IC34.17(7D) ; also sheet 1,4,10
DATA7: IC34.18(8D) ; also sheet 1,4,10
DEST-ADDR: IC37.1(A:G) ; also sheet 2
GND: IC34.1(OC) ; also sheet 1,3,5,7,8,9,10
LADDR-REG-ID0: IC39.11(B:A1) ; also sheet 2
LADDR-REG-ID1: IC39.13(B:A2) ; also sheet 2
LADDR-REG-ID2: IC39.15(B:A3) ; also sheet 2
LADDR-REG-ID3: IC39.17(B:A4) ; also sheet 2
LREG-LD-ID0: IC32.11(B:A1) ; also sheet 2
LREG-LD-ID1: IC32.13(B:A2) ; also sheet 2
LREG-LD-ID2: IC32.15(B:A3) ; also sheet 2
LREG-LD-ID3: IC32.17(B:A4) ; also sheet 2
LREG-RD-ID0: IC32.2(A:A1) ; also sheet 2
LREG-RD-ID1: IC32.4(A:A2) ; also sheet 2
LREG-RD-ID2: IC32.6(A:A3) ; also sheet 2
LREG-RD-ID3: IC32.8(A:A4) ; also sheet 2
N$61: IC33.17(B:A4) IC34.19(8Q) IC37.8(A:A4)
N$62: IC33.2(A:A1) IC34.2(1Q) IC39.2(A:A1)
N$63: IC33.4(A:A2) IC34.5(2Q) IC39.4(A:A2)
N$64: IC33.6(A:A3) IC34.6(3Q) IC39.6(A:A3)
N$65: IC33.8(A:A4) IC34.9(4Q) IC39.8(A:A4)
N$66: IC33.11(B:A1) IC34.12(5Q) IC37.2(A:A1)
N$68: IC33.13(B:A2) IC34.15(6Q) IC37.4(A:A2)
N$69: IC33.15(B:A3) IC34.16(7Q) IC37.6(A:A3)
OPERAND-CLK: IC34.11(CLK) ; also sheet 2
REG-LD-ID0: IC32.9(B:Y1) IC33.9(B:Y1) ; also sheet 4,10
REG-LD-ID1: IC32.7(B:Y2) IC33.7(B:Y2) ; also sheet 4,10
REG-LD-ID2: IC32.5(B:Y3) IC33.5(B:Y3) ; also sheet 4,10
REG-LD-ID3: IC32.3(B:Y4) IC33.3(B:Y4) ; also sheet 4,10
REG-RD-ID0: IC32.18(A:Y1) IC33.18(A:Y1) ; also sheet 10
REG-RD-ID1: IC32.16(A:Y2) IC33.16(A:Y2) ; also sheet 10
REG-RD-ID2: IC32.14(A:Y3) IC33.14(A:Y3) ; also sheet 10
REG-RD-ID3: IC32.12(A:Y4) IC33.12(A:Y4) ; also sheet 10
SRC-ADDR: IC39.1(A:G) ; also sheet 2

### Notes on the sheet
- Should operand clk be part of mem-logic or generated siginal
- drive reg-rd/ld and ioaddr from separte signals and add to drive addr line driving

## Sheet 7 of 10: BYPASS and UNUSED
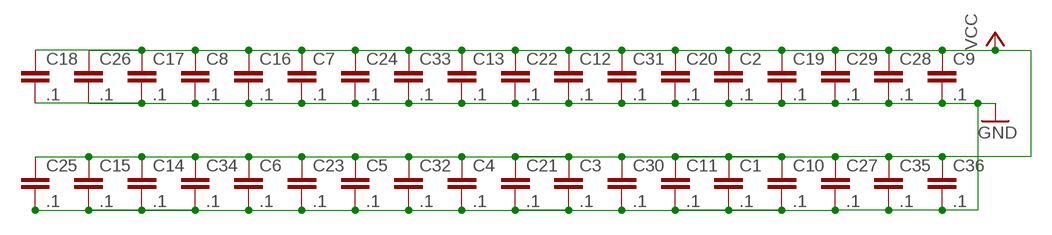
[diagram p6: schematic, sheet 7]

### Parts
C1  .1  CAPEZ  [CAP-PTH-SMALLEZ]
C2  .1  CAPEZ  [CAP-PTH-SMALLEZ]
C3  .1  CAPEZ  [CAP-PTH-SMALLEZ]
C4  .1  CAPEZ  [CAP-PTH-SMALLEZ]
C5  .1  CAPEZ  [CAP-PTH-SMALLEZ]
C6  .1  CAPEZ  [CAP-PTH-SMALLEZ]
C7  .1  CAPEZ  [CAP-PTH-SMALLEZ]
C8  .1  CAPEZ  [CAP-PTH-SMALLEZ]
C9  .1  CAPEZ  [CAP-PTH-SMALLEZ]
C10  .1  CAPEZ  [CAP-PTH-SMALLEZ]
C11  .1  CAPEZ  [CAP-PTH-SMALLEZ]
C12  .1  CAPEZ  [CAP-PTH-SMALLEZ]
C13  .1  CAPEZ  [CAP-PTH-SMALLEZ]
C14  .1  CAPEZ  [CAP-PTH-SMALLEZ]
C15  .1  CAPEZ  [CAP-PTH-SMALLEZ]
C16  .1  CAPEZ  [CAP-PTH-SMALLEZ]
C17  .1  CAPEZ  [CAP-PTH-SMALLEZ]
C18  .1  CAPEZ  [CAP-PTH-SMALLEZ]
C19  .1  CAPEZ  [CAP-PTH-SMALLEZ]
C20  .1  CAPEZ  [CAP-PTH-SMALLEZ]
C21  .1  CAPEZ  [CAP-PTH-SMALLEZ]
C22  .1  CAPEZ  [CAP-PTH-SMALLEZ]
C23  .1  CAPEZ  [CAP-PTH-SMALLEZ]
C24  .1  CAPEZ  [CAP-PTH-SMALLEZ]
C25  .1  CAPEZ  [CAP-PTH-SMALLEZ]
C26  .1  CAPEZ  [CAP-PTH-SMALLEZ]
C27  .1  CAPEZ  [CAP-PTH-SMALLEZ]
C28  .1  CAPEZ  [CAP-PTH-SMALLEZ]
C29  .1  CAPEZ  [CAP-PTH-SMALLEZ]
C30  .1  CAPEZ  [CAP-PTH-SMALLEZ]
C31  .1  CAPEZ  [CAP-PTH-SMALLEZ]
C32  .1  CAPEZ  [CAP-PTH-SMALLEZ]
C33  .1  CAPEZ  [CAP-PTH-SMALLEZ]
C34  .1  CAPEZ  [CAP-PTH-SMALLEZ]
C35  .1  CAPEZ  [CAP-PTH-SMALLEZ]
C36  .1  CAPEZ  [CAP-PTH-SMALLEZ]

### Nets
GND: C1.2 C2.2 C3.2 C4.2 C5.2 C6.2 C7.2 C8.2 C9.2 C10.2 C11.2 C12.2 C13.2 C14.2 C15.2 C16.2 C17.2 C18.2 C19.2 C20.2 C21.2 C22.2 C23.2 C24.2 C25.2 C26.2 C27.2 C28.2 C29.2 C30.2 C31.2 C32.2 C33.2 C34.2 C35.2 C36.2 ; also sheet 1,3,5,6,8,9,10
VCC: C1.1 C2.1 C3.1 C4.1 C5.1 C6.1 C7.1 C8.1 C9.1 C10.1 C11.1 C12.1 C13.1 C14.1 C15.1 C16.1 C17.1 C18.1 C19.1 C20.1 C21.1 C22.1 C23.1 C24.1 C25.1 C26.1 C27.1 C28.1 C29.1 C30.1 C31.1 C32.1 C33.1 C34.1 C35.1 C36.1 ; also sheet 1,3,5,9,10

## Sheet 8 of 10: BUS
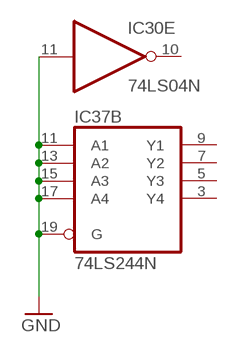
[diagram p7: schematic, sheet 8]

### Nets
GND: IC30.11(E:I) IC37.11(B:A1) IC37.13(B:A2) IC37.15(B:A3) IC37.17(B:A4) IC37.19(B:G) ; also sheet 1,3,5,6,7,9,10
Unconnected: IC30.10(E:O) IC37.3(B:Y4) IC37.5(B:Y3) IC37.7(B:Y2) IC37.9(B:Y1)

## Sheet 9 of 10
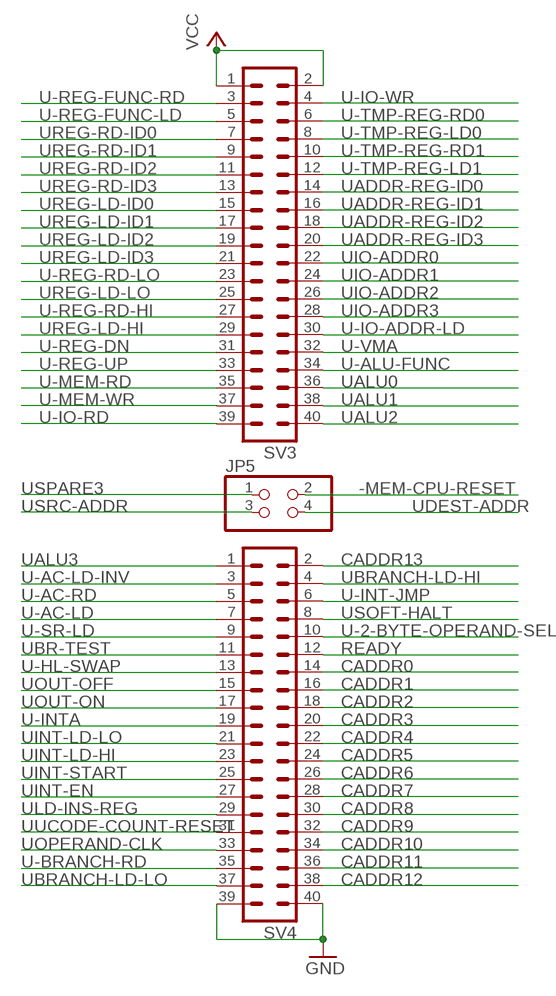
[diagram p8: schematic, sheet 9]

### Parts
JP5  PINHD-2X2  [2X02]
SV3  MA20-2  [MA20-2]
SV4  MA20-2  [MA20-2]

### Nets
-MEM-CPU-RESET: JP5.2 ; also sheet 2
CADDR0: SV4.14 ; also sheet 1
CADDR1: SV4.16 ; also sheet 1
CADDR2: SV4.18 ; also sheet 1
CADDR3: SV4.20 ; also sheet 1
CADDR4: SV4.22 ; also sheet 1
CADDR5: SV4.24 ; also sheet 1
CADDR6: SV4.26 ; also sheet 1
CADDR7: SV4.28 ; also sheet 1
CADDR8: SV4.30 ; also sheet 1
CADDR9: SV4.32 ; also sheet 1
CADDR10: SV4.34 ; also sheet 1
CADDR11: SV4.36 ; also sheet 1
CADDR12: SV4.38 ; also sheet 1
CADDR13: SV4.2 ; also sheet 1
GND: SV4.39 SV4.40 ; also sheet 1,3,5,6,7,8,10
READY: SV4.12 ; also sheet 1
U-2-BYTE-OPERAND-SEL: SV4.10 ; also sheet 2
U-AC-LD: SV4.7 ; also sheet 2
U-AC-LD-INV: SV4.3 ; also sheet 2
U-AC-RD: SV4.5 ; also sheet 2
U-ALU-FUNC: SV3.34 ; also sheet 2
U-BRANCH-RD: SV4.35 ; also sheet 2
U-HL-SWAP: SV4.13 ; also sheet 2
U-INT-JMP: SV4.6 ; also sheet 2
U-INTA: SV4.19 ; also sheet 2
U-IO-ADDR-LD: SV3.30 ; also sheet 2
U-IO-RD: SV3.39 ; also sheet 2
U-IO-WR: SV3.4 ; also sheet 2
U-MEM-RD: SV3.35 ; also sheet 2
U-MEM-WR: SV3.37 ; also sheet 2
U-REG-DN: SV3.31 ; also sheet 2
U-REG-FUNC-LD: SV3.5 ; also sheet 2
U-REG-FUNC-RD: SV3.3 ; also sheet 2
U-REG-RD-HI: SV3.27 ; also sheet 2
U-REG-RD-LO: SV3.23 ; also sheet 2
U-REG-UP: SV3.33 ; also sheet 2
U-SR-LD: SV4.9 ; also sheet 2
U-TMP-REG-LD0: SV3.8 ; also sheet 2
U-TMP-REG-LD1: SV3.12 ; also sheet 2
U-TMP-REG-RD0: SV3.6 ; also sheet 2
U-TMP-REG-RD1: SV3.10 ; also sheet 2
U-VMA: SV3.32 ; also sheet 2
UADDR-REG-ID0: SV3.14 ; also sheet 2
UADDR-REG-ID1: SV3.16 ; also sheet 2
UADDR-REG-ID2: SV3.18 ; also sheet 2
UADDR-REG-ID3: SV3.20 ; also sheet 2
UALU0: SV3.36 ; also sheet 2
UALU1: SV3.38 ; also sheet 2
UALU2: SV3.40 ; also sheet 2
UALU3: SV4.1 ; also sheet 2
UBR-TEST: SV4.11 ; also sheet 2
UBRANCH-LD-HI: SV4.4 ; also sheet 2
UBRANCH-LD-LO: SV4.37 ; also sheet 2
UDEST-ADDR: JP5.4 ; also sheet 2
UINT-EN: SV4.27 ; also sheet 2
UINT-LD-HI: SV4.23 ; also sheet 2
UINT-LD-LO: SV4.21 ; also sheet 2
UINT-START: SV4.25 ; also sheet 2
UIO-ADDR0: SV3.22 ; also sheet 2
UIO-ADDR1: SV3.24 ; also sheet 2
UIO-ADDR2: SV3.26 ; also sheet 2
UIO-ADDR3: SV3.28 ; also sheet 2
ULD-INS-REG: SV4.29 ; also sheet 2
UOPERAND-CLK: SV4.33 ; also sheet 2
UOUT-OFF: SV4.15 ; also sheet 2
UOUT-ON: SV4.17 ; also sheet 2
UREG-LD-HI: SV3.29 ; also sheet 2
UREG-LD-ID0: SV3.15 ; also sheet 2
UREG-LD-ID1: SV3.17 ; also sheet 2
UREG-LD-ID2: SV3.19 ; also sheet 2
UREG-LD-ID3: SV3.21 ; also sheet 2
UREG-LD-LO: SV3.25 ; also sheet 2
UREG-RD-ID0: SV3.7 ; also sheet 2
UREG-RD-ID1: SV3.9 ; also sheet 2
UREG-RD-ID2: SV3.11 ; also sheet 2
UREG-RD-ID3: SV3.13 ; also sheet 2
USOFT-HALT: SV4.8 ; also sheet 2
USPARE3: JP5.1 ; also sheet 2
USRC-ADDR: JP5.3 ; also sheet 2
UUCODE-COUNT-RESET: SV4.31 ; also sheet 2
VCC: SV3.1 SV3.2 ; also sheet 1,3,5,7,10

## Sheet 10 of 10
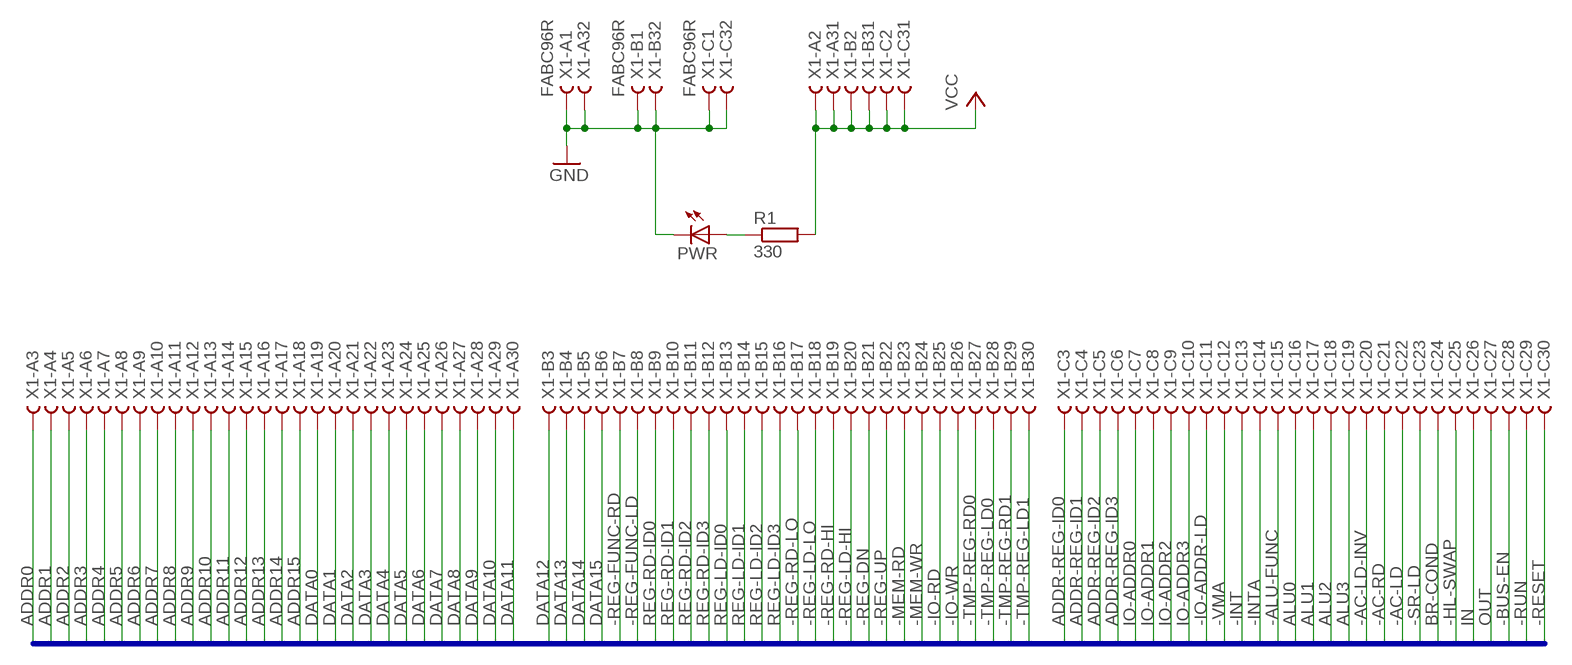
[diagram p9: schematic, sheet 10]

### Parts
PWR  LED5MM  [LED5MM]
R1  330  R0207/10  [0207/10]
X1  FABC96R  [FABC96R]

### Nets
-AC-LD: X1.C22 ; also sheet 2
-AC-LD-INV: X1.C20 ; also sheet 2
-AC-RD: X1.C21 ; also sheet 2
-ALU-FUNC: X1.C15 ; also sheet 2
-BUS-EN: X1.C28 ; also sheet 1,2
-HL-SWAP: X1.C25 ; also sheet 2
-INT: X1.C13 ; also sheet 3
-INTA: X1.C14 ; also sheet 2
-IO-ADDR-LD: X1.C11 ; also sheet 2
-IO-RD: X1.B25 ; also sheet 2
-IO-WR: X1.B26 ; also sheet 2
-MEM-RD: X1.B23 ; also sheet 2
-MEM-WR: X1.B24 ; also sheet 2
-REG-DN: X1.B21 ; also sheet 2
-REG-FUNC-LD: X1.B8 ; also sheet 2
-REG-FUNC-RD: X1.B7 ; also sheet 2
-REG-LD-HI: X1.B20 ; also sheet 4
-REG-LD-LO: X1.B18 ; also sheet 4
-REG-RD-HI: X1.B19 ; also sheet 2
-REG-RD-LO: X1.B17 ; also sheet 2
-REG-UP: X1.B22 ; also sheet 2
-RESET: X1.C30 ; also sheet 1
-RUN: X1.C29
-SR-LD: X1.C23 ; also sheet 2
-TMP-REG-LD0: X1.B28 ; also sheet 2
-TMP-REG-LD1: X1.B30 ; also sheet 2
-TMP-REG-RD0: X1.B27 ; also sheet 2
-TMP-REG-RD1: X1.B29 ; also sheet 2
-VMA: X1.C12 ; also sheet 2
ADDR0: X1.A3
ADDR1: X1.A4
ADDR2: X1.A5
ADDR3: X1.A6
ADDR4: X1.A7
ADDR5: X1.A8
ADDR6: X1.A9
ADDR7: X1.A10
ADDR8: X1.A11
ADDR9: X1.A12
ADDR10: X1.A13
ADDR11: X1.A14
ADDR12: X1.A15
ADDR13: X1.A16
ADDR14: X1.A17
ADDR15: X1.A18
ADDR-REG-ID0: X1.C3 ; also sheet 6
ADDR-REG-ID1: X1.C4 ; also sheet 6
ADDR-REG-ID2: X1.C5 ; also sheet 6
ADDR-REG-ID3: X1.C6 ; also sheet 6
ALU0: X1.C16 ; also sheet 2
ALU1: X1.C17 ; also sheet 2
ALU2: X1.C18 ; also sheet 2
ALU3: X1.C19 ; also sheet 2
BR-COND: X1.C24 ; also sheet 4
DATA0: X1.A19 ; also sheet 1,4,6
DATA1: X1.A20 ; also sheet 1,4,6
DATA2: X1.A21 ; also sheet 1,4,6
DATA3: X1.A22 ; also sheet 1,4,6
DATA4: X1.A23 ; also sheet 1,4,6
DATA5: X1.A24 ; also sheet 1,4,6
DATA6: X1.A25 ; also sheet 1,4,6
DATA7: X1.A26 ; also sheet 1,4,6
DATA8: X1.A27 ; also sheet 4
DATA9: X1.A28 ; also sheet 4
DATA10: X1.A29 ; also sheet 4
DATA11: X1.A30 ; also sheet 4
DATA12: X1.B3 ; also sheet 4
DATA13: X1.B4 ; also sheet 4
DATA14: X1.B5 ; also sheet 4
DATA15: X1.B6 ; also sheet 4
GND: PWR.K(C) X1.A1 X1.A32 X1.B1 X1.B32 X1.C1 X1.C32 ; also sheet 1,3,5,6,7,8,9
IN: X1.C26
IO-ADDR0: X1.C7 ; also sheet 2
IO-ADDR1: X1.C8 ; also sheet 2
IO-ADDR2: X1.C9 ; also sheet 2
IO-ADDR3: X1.C10 ; also sheet 2
N$30: PWR.A R1.1
OUT: X1.C27 ; also sheet 3,5
REG-LD-ID0: X1.B13 ; also sheet 4,6
REG-LD-ID1: X1.B14 ; also sheet 4,6
REG-LD-ID2: X1.B15 ; also sheet 4,6
REG-LD-ID3: X1.B16 ; also sheet 4,6
REG-RD-ID0: X1.B9 ; also sheet 6
REG-RD-ID1: X1.B10 ; also sheet 6
REG-RD-ID2: X1.B11 ; also sheet 6
REG-RD-ID3: X1.B12 ; also sheet 6
VCC: R1.2 X1.A2 X1.A31 X1.B2 X1.B31 X1.C2 X1.C31 ; also sheet 1,3,5,7,9

### Buses
MAINBUS:-AC-LD,-AC-LD-INV,-AC-RD,ADDR[0..15],ADDR-REG-ID0,ADDR-REG-ID1,ADDR-REG-ID2,ADDR-REG-ID3,ALU[0..3],-ALU-FUNC,BR-COND,-BUS-EN,DATA[0..15],-HL-SWAP,IN,-INT,-INTA,IO-ADDR[0..3],-IO-ADDR-LD,-IO-RD,-IO-WR,-MEM-RD,-MEM-WR,OUT,-REG-DN,-REG-FUNC-LD,-REG-FUNC-RD,-REG-LD-HI,REG-LD-ID[0..3],-REG-LD-LO,-REG-RD-HI,REG-RD-ID[0..3],-REG-RD-LO,-REG-UP,-RESET,-RUN,-SR-LD,-TMP-REG-LD[0..1],-TMP-REG-RD[0..1],-VMA

## Power pins joined to a net without a drawn wire
GND: IC1.10(P:GND) IC2.10(P:GND) IC3.8(GND) IC4.8(GND) IC5.8(GND) IC6.8(GND) IC7.7(P:GND) IC8.10(P:GND) IC9.10(P:GND) IC10.7(P:GND) IC11.7(P:GND) IC12.7(P:GND) IC13.10(GND) IC14.10(GND) IC15.10(GND) IC16.10(GND) IC17.10(GND) IC18.10(GND) IC19.10(GND) IC20.10(GND) IC21.7(P:GND) IC22.7(P:GND) IC23.7(P:GND) IC24.7(P:GND) IC25.10(GND) IC26.10(GND) IC27.10(GND) IC28.10(GND) IC29.7(P:GND) IC30.7(P:GND) IC31.7(P:GND) IC32.10(P:GND) IC33.10(P:GND) IC34.10(GND) IC35.7(P:GND) IC36.7(P:GND) IC37.10(P:GND) IC39.10(P:GND) QG1.7(GND)
VCC: IC1.20(P:VCC) IC2.20(P:VCC) IC3.16(VCC) IC4.16(VCC) IC5.16(VCC) IC6.16(VCC) IC7.14(P:VCC) IC8.20(P:VCC) IC9.20(P:VCC) IC10.14(P:VCC) IC11.14(P:VCC) IC12.14(P:VCC) IC13.20(VCC) IC14.20(VCC) IC15.20(VCC) IC16.20(VCC) IC17.20(VCC) IC18.20(VCC) IC19.20(VCC) IC20.20(VCC) IC21.14(P:VCC) IC22.14(P:VCC) IC23.14(P:VCC) IC24.14(P:VCC) IC25.20(VCC) IC26.20(VCC) IC27.20(VCC) IC28.20(VCC) IC29.14(P:VCC) IC30.14(P:VCC) IC31.14(P:VCC) IC32.20(P:VCC) IC33.20(P:VCC) IC34.20(VCC) IC35.14(P:VCC) IC36.14(P:VCC) IC37.20(P:VCC) IC39.20(P:VCC) QG1.14(VCC)

## Library data of the parts
-INT-PULLUP = pinhead:PINHD-1X2: PIN HEADER
. PWR = led:LED: LED OSRAM: - CHIPLED LG R971, LG N971, LY N971, LG Q971, LY Q971, LO R971, LY R971 LH N974, LH R974 LS Q976, LO Q976, LY Q976 LO Q996 - Hyper CHIPLED LW Q18S LB Q993, LB Q99A, LB R99A - SideLED LS A670, LO A670, LY A670, LG A670, LP A670 LB A673, LV A673, LT A673, LW A673 LH A674 LY A675 LS A676, LA A676, LO A676, LY A676, LW A676 LS A679, LY A679, LG A679 - Hyper Micro SIDELED® LS Y876, LA Y876, LO Y876, LY Y876 LT Y87S - SmartLED LW L88C, LW L88S LB L89C, LB L89S, LG L890 LS L89K, LO L89K, LY L89K LS L896, LA L896, LO L896, LY L896 - TOPLED LS T670, LO T670, LY T670, LG T670, LP T670 LSG T670, LSP T670, LSY T670, LOP T670, LYG T670 LG T671, LOG T671, LSG T671 LB T673, LV T673, LT T673, LW T673 LH T674 LS T676, LA T676, LO T676, LY T676, LB T676, LH T676, LSB T676, LW T676 LB T67C, LV T67C, LT T67C, LS T67K, LO T67K, LY T67K, LW E67C LS E67B, LA E67B, LO E67B, LY E67B, LB E67C, LV E67C, LT E67C LW T67C LS T679, LY T679, LG T679 LS T770, LO T770, LY T770, LG T770, LP T770 LB T773, LV T773, LT T773, LW T773 LH T774 LS E675, LA E675, LY E675, LS T675 LS T776, LA T776, LO T776, LY T776, LB T776 LHGB T686 LT T68C, LB T68C - Hyper Mini TOPLED® LB M676 - Mini TOPLED Santana® LG M470 LS M47K, LO M47K, LY M47K Source: http://www.osram.convergy.de LUXEON: - LUMILED® LXK2-PW12-R00, LXK2-PW12-S00, LXK2-PW14-U00, LXK2-PW14-V00 LXK2-PM12-R00, LXK2-PM12-S00, LXK2-PM14-U00 LXK2-PE12-Q00, LXK2-PE12-R00, LXK2-PE12-S00, LXK2-PE14-T00, LXK2-PE14-U00 LXK2-PB12-K00, LXK2-PB12-L00, LXK2-PB12-M00, LXK2-PB14-N00, LXK2-PB14-P00, LXK2-PB14-Q00 LXK2-PR12-L00, LXK2-PR12-M00, LXK2-PR14-Q00, LXK2-PR14-R00 LXK2-PD12-Q00, LXK2-PD12-R00, LXK2-PD12-S00 LXK2-PH12-R00, LXK2-PH12-S00 LXK2-PL12-P00, LXK2-PL12-Q00, LXK2-PL12-R00 Source: www.luxeon.com KINGBRIGHT: KA-3528ASYC Source: www.kingbright.com
C1-C36 = SparkFun-Capacitors:CAP: Capacitor Standard 0603 ceramic capacitor, and 0.1" leaded capacitor.
CONT HALT = SparkFun-Electromechanical:SWITCH-MOMENTARY-2: Various NO switches- pushbuttons, reed, etc
EXT-SS-CLK SS-SEL = pinhead:PINHD-1X3: PIN HEADER
IC1 IC2 IC8 IC9 IC32 IC33 IC37 IC39 = 74xx-us:74*244: Octal BUFFER and LINE DRIVER, 3-state
IC3 IC4 = 74xx-us:74*175: Qadruple D type FLIP FLOP, clear
IC5 IC6 = 74xx-us:74*192: Synchronous 4-bit UP/DOWN COUNTER
IC7 IC12 IC29 = 74xx-us:74*08: Quad 2-input AND gate
IC10 IC24 IC35 = 74xx-us:74*32: Quad 2-input OR gate
IC11 IC30 IC36 = 74xx-us:74*04: Hex INVERTER
IC13-IC20 IC25-IC28 IC34 = 74xx-us:74*374: Octal D type transparent LATCH, edge triggered
IC21 IC23 IC31 = 74xx-us:74*02: Quad 2-input NOR gate
IC22 = 74xx-us:74*74: Dual D type positive edge triggered FLIP FLOP, preset and clear
JP1 = pinhead:PINHD-1X5: PIN HEADER
JP2 = Connector:PINHD-1X2: PIN HEADER; CATEGORY: CONNECTOR; SUB-CATEGORY: PIN-HEADER
JP5 = pinhead:PINHD-2X2: PIN HEADER
QG1 = crystal:XO-: CRYSTAL; OC_FARNELL: unknown; OC_NEWARK: unknown
R1 R10 = eagle-ltspice:R: RESISTOR, European symbol; SPICEMODEL: NONE; SPICEPREFIX: R
R2-R9 R16 = adafruit:R-US_: RESISTOR, American symbol
RESET SS/WAIT STEP-CLK = switch:9070-1W: TOGGLE SWITCH Marquardt
SV3 SV4 = con-lstb:MA20-2: PIN HEADER; OC_FARNELL: unknown; OC_NEWARK: unknown
X1 = con-vg:FABC96R: CONNECTOR female, 96 pins, type R, rows ABC, grid 2.54 mm